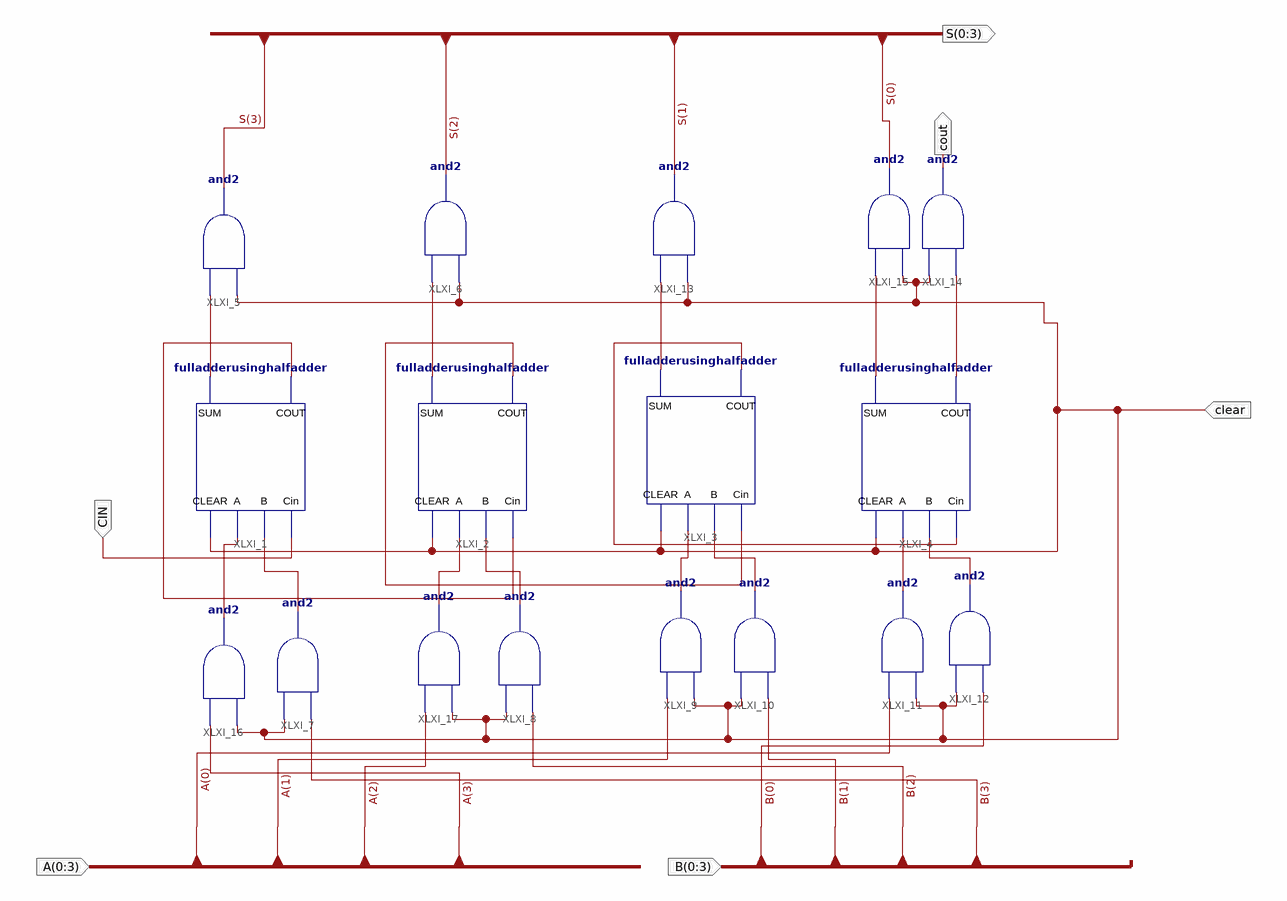
[diagram p0: schematic sheet 1]
// Xilinx ISE schematic Busfourbitadder.sch (artix7) as structural Verilog: 17 symbols, 6 ports
module Busfourbitadder (
  input  CIN,
  input  clear,
  input  [0:3] A,
  input  [0:3] B,
  output [0:3] S,
  output cout
);

  wire XLXN_1, XLXN_2, XLXN_3, XLXN_4, XLXN_5, XLXN_6, XLXN_7, XLXN_8, XLXN_11, XLXN_12, XLXN_25, XLXN_26,
       XLXN_38, XLXN_41, XLXN_42, XLXN_43;

  fulladderusinghalfadder XLXI_1 (.CLEAR(clear), .A(XLXN_12), .B(XLXN_6), .Cin(CIN), .SUM(XLXN_1), .COUT(XLXN_41));
  fulladderusinghalfadder XLXI_2 (.CLEAR(clear), .A(XLXN_7), .B(XLXN_8), .Cin(XLXN_41), .SUM(XLXN_2), .COUT(XLXN_42));
  fulladderusinghalfadder XLXI_3 (.CLEAR(clear), .A(XLXN_25), .B(XLXN_26), .Cin(XLXN_42), .SUM(XLXN_3), .COUT(XLXN_43));
  fulladderusinghalfadder XLXI_4 (.CLEAR(clear), .A(XLXN_11), .B(XLXN_38), .Cin(XLXN_43), .SUM(XLXN_4), .COUT(XLXN_5));
  and XLXI_5 (S[3], clear, XLXN_1);
  and XLXI_6 (S[2], clear, XLXN_2);
  and XLXI_7 (XLXN_6, B[3], clear);
  and XLXI_8 (XLXN_8, B[2], clear);
  and XLXI_9 (XLXN_25, clear, A[1]);
  and XLXI_10 (XLXN_26, B[1], clear);
  and XLXI_11 (XLXN_11, clear, A[0]);
  and XLXI_12 (XLXN_38, B[0], clear);
  and XLXI_13 (S[1], clear, XLXN_3);
  and XLXI_14 (cout, XLXN_5, clear);
  and XLXI_15 (S[0], clear, XLXN_4);
  and XLXI_16 (XLXN_12, clear, A[3]);
  and XLXI_17 (XLXN_7, clear, A[2]);
endmodule
